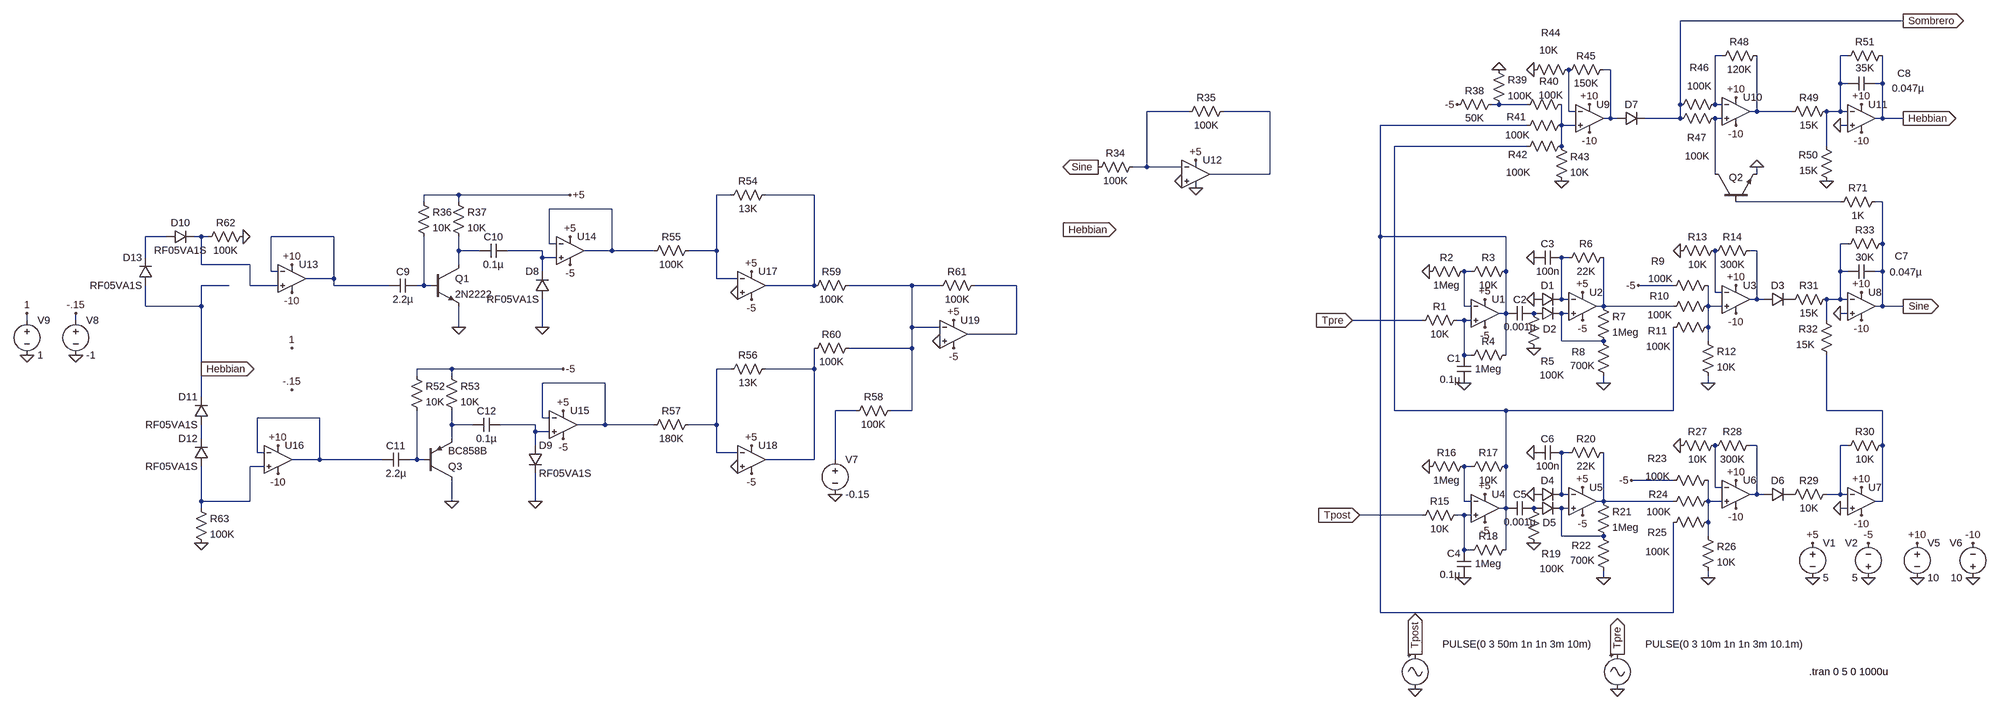
[diagram p0: schematic In-Ex-PulseV2.asc]
In-Ex-PulseV2.asc, the LTspice schematic file:
Version 4
SHEET 1 2784 1552
WIRE 1184 -672 672 -672
WIRE 768 -592 752 -592
WIRE 1056 -592 1040 -592
WIRE 512 -560 496 -560
WIRE 1040 -528 1040 -592
WIRE 1056 -528 1040 -528
WIRE 1136 -528 1136 -592
WIRE 1136 -528 1120 -528
WIRE 256 -480 240 -480
WIRE 320 -480 256 -480
WIRE 672 -480 672 -672
WIRE 752 -480 752 -592
WIRE 768 -480 752 -480
WIRE -1424 -464 -1520 -464
WIRE -1216 -464 -1344 -464
WIRE 416 -464 416 -560
WIRE 432 -464 416 -464
WIRE 848 -464 848 -592
WIRE 848 -464 832 -464
WIRE 928 -464 848 -464
WIRE 1040 -464 1040 -528
WIRE 1040 -464 1008 -464
WIRE 1056 -464 1040 -464
WIRE 512 -448 512 -560
WIRE 512 -448 496 -448
WIRE 528 -448 512 -448
WIRE 672 -448 672 -480
WIRE 672 -448 592 -448
WIRE 768 -448 752 -448
WIRE 1136 -448 1136 -528
WIRE 1136 -448 1120 -448
WIRE 1184 -448 1136 -448
WIRE 320 -432 -16 -432
WIRE 400 -432 400 -480
WIRE 432 -432 400 -432
WIRE 1056 -432 1040 -432
WIRE 320 -384 16 -384
WIRE 400 -384 400 -432
WIRE 1008 -384 1008 -464
WIRE -1520 -336 -1520 -464
WIRE -1520 -336 -1552 -336
WIRE -1440 -336 -1520 -336
WIRE -1216 -320 -1216 -464
WIRE -1216 -320 -1376 -320
WIRE 752 -320 752 -448
WIRE 848 -320 848 -336
WIRE -3248 -272 -3328 -272
WIRE -2992 -272 -3248 -272
WIRE -2624 -272 -2656 -272
WIRE -2432 -272 -2544 -272
WIRE -3328 -256 -3328 -272
WIRE -3248 -256 -3248 -272
WIRE 1040 -256 800 -256
WIRE 1136 -256 1120 -256
WIRE -2896 -240 -3040 -240
WIRE -3952 -176 -4000 -176
WIRE -3872 -176 -3888 -176
WIRE -3856 -176 -3872 -176
WIRE -3568 -176 -3712 -176
WIRE -16 -176 -16 -432
WIRE 272 -176 -16 -176
WIRE -3040 -160 -3040 -240
WIRE -3024 -160 -3040 -160
WIRE 1056 -160 1040 -160
WIRE 1136 -160 1136 -256
WIRE -3248 -144 -3248 -176
WIRE -3200 -144 -3248 -144
WIRE -3056 -144 -3136 -144
WIRE -2896 -144 -2896 -240
WIRE -2896 -144 -2960 -144
WIRE -2800 -144 -2896 -144
WIRE -2656 -144 -2656 -272
WIRE -2656 -144 -2720 -144
WIRE 848 -144 832 -144
WIRE -4000 -128 -4000 -176
WIRE -3056 -128 -3056 -144
WIRE -3024 -128 -3056 -128
WIRE 416 -128 400 -128
WIRE -3872 -112 -3872 -176
WIRE -3760 -112 -3872 -112
WIRE -3248 -112 -3248 -144
WIRE -3712 -96 -3712 -176
WIRE -3696 -96 -3712 -96
WIRE -3056 -96 -3056 -128
WIRE 192 -96 176 -96
WIRE 272 -96 272 -176
WIRE 1040 -96 1040 -160
WIRE 1056 -96 1040 -96
WIRE 1136 -96 1136 -160
WIRE 1136 -96 1120 -96
WIRE -3568 -80 -3568 -176
WIRE -3568 -80 -3632 -80
WIRE -2656 -80 -2656 -144
WIRE -2608 -80 -2656 -80
WIRE -3808 -64 -3872 -64
WIRE -3760 -64 -3760 -112
WIRE -3696 -64 -3760 -64
WIRE -3568 -64 -3568 -80
WIRE -3408 -64 -3568 -64
WIRE -3328 -64 -3328 -176
WIRE -3328 -64 -3344 -64
WIRE -3312 -64 -3328 -64
WIRE -2432 -64 -2432 -272
WIRE -2432 -64 -2544 -64
WIRE -2208 -64 -2352 -64
WIRE -2144 -64 -2208 -64
WIRE -1968 -64 -2064 -64
WIRE 656 -64 576 -64
WIRE 752 -48 752 -144
WIRE 768 -48 752 -48
WIRE 400 -32 400 -128
WIRE 416 -32 400 -32
WIRE 848 -32 848 -144
WIRE 848 -32 832 -32
WIRE 864 -32 848 -32
WIRE 1040 -32 1040 -96
WIRE 1040 -32 1008 -32
WIRE 1056 -32 1040 -32
WIRE -4000 -16 -4000 -64
WIRE -3872 -16 -3872 -64
WIRE -3872 -16 -4000 -16
WIRE 176 -16 176 -96
WIRE 192 -16 176 -16
WIRE 496 -16 496 -128
WIRE 496 -16 480 -16
WIRE 656 -16 496 -16
WIRE 736 -16 736 -64
WIRE 768 -16 736 -16
WIRE 1136 -16 1136 -96
WIRE 1136 -16 1120 -16
WIRE 1184 -16 1136 -16
WIRE 272 0 272 -96
WIRE 272 0 256 0
WIRE 416 0 400 0
WIRE 1056 0 1040 0
WIRE -4272 16 -4272 0
WIRE -4160 16 -4160 0
WIRE 80 16 -80 16
WIRE 176 16 160 16
WIRE 192 16 176 16
WIRE 1008 16 1008 -32
WIRE -3248 32 -3248 -16
WIRE -3056 32 -3056 -32
WIRE -2208 32 -2208 -64
WIRE -2144 32 -2208 32
WIRE 736 32 736 -16
WIRE -1968 48 -1968 -64
WIRE -1968 48 -2080 48
WIRE 400 64 400 0
WIRE 496 64 400 64
WIRE 736 64 736 32
WIRE -2208 80 -2208 32
WIRE -2208 80 -2352 80
WIRE 176 96 176 16
WIRE 192 96 176 96
WIRE 272 96 272 0
WIRE -3872 128 -3872 -16
WIRE -3264 128 -3344 128
WIRE -3008 128 -3264 128
WIRE -2624 128 -2656 128
WIRE -2432 128 -2432 80
WIRE -2432 128 -2544 128
WIRE -3344 144 -3344 128
WIRE -3264 144 -3264 128
WIRE -2912 160 -3056 160
WIRE 496 160 496 144
WIRE 736 160 736 144
WIRE -3872 192 -3872 128
WIRE -2336 224 -2384 224
WIRE -2208 224 -2208 80
WIRE -2208 224 -2256 224
WIRE 16 224 16 -384
WIRE 272 224 16 224
WIRE 656 224 656 32
WIRE 656 224 272 224
WIRE 1008 224 1008 96
WIRE 1136 224 1008 224
WIRE -3600 240 -3744 240
WIRE -3056 240 -3056 160
WIRE -3040 240 -3056 240
WIRE -3264 256 -3264 224
WIRE -3216 256 -3264 256
WIRE -3072 256 -3152 256
WIRE -2912 256 -2912 160
WIRE -2912 256 -2976 256
WIRE -2800 256 -2912 256
WIRE -2656 256 -2656 128
WIRE -2656 256 -2720 256
WIRE -3072 272 -3072 256
WIRE -3040 272 -3072 272
WIRE -3872 288 -3872 256
WIRE -3264 288 -3264 256
WIRE -3072 304 -3072 272
WIRE 848 304 832 304
WIRE 1056 304 1040 304
WIRE 1136 304 1136 224
WIRE -3744 320 -3744 240
WIRE -3728 320 -3744 320
WIRE -2656 320 -2656 256
WIRE -2608 320 -2656 320
WIRE 416 320 400 320
WIRE -3600 336 -3600 240
WIRE -3600 336 -3664 336
WIRE -3424 336 -3600 336
WIRE -3344 336 -3344 224
WIRE -3344 336 -3360 336
WIRE -3328 336 -3344 336
WIRE -2432 336 -2432 128
WIRE -2432 336 -2544 336
WIRE -2384 336 -2384 224
WIRE -3728 352 -3760 352
WIRE 192 352 176 352
WIRE 272 352 272 224
WIRE 656 384 560 384
WIRE 752 400 752 304
WIRE 768 400 752 400
WIRE 400 416 400 320
WIRE 416 416 400 416
WIRE 848 416 848 304
WIRE 848 416 832 416
WIRE 864 416 848 416
WIRE 1040 416 1040 304
WIRE 1040 416 1008 416
WIRE 1056 416 1040 416
WIRE -3872 432 -3872 352
WIRE -3760 432 -3760 352
WIRE -3760 432 -3872 432
WIRE -3264 432 -3264 384
WIRE -3072 432 -3072 368
WIRE 176 432 176 352
WIRE 192 432 176 432
WIRE 496 432 496 320
WIRE 496 432 480 432
WIRE 656 432 496 432
WIRE 736 432 736 384
WIRE 768 432 736 432
WIRE 1136 432 1136 304
WIRE 1136 432 1120 432
WIRE -3872 448 -3872 432
WIRE 272 448 272 352
WIRE 272 448 256 448
WIRE 416 448 400 448
WIRE 1056 448 1040 448
WIRE 80 464 -64 464
WIRE 176 464 160 464
WIRE 192 464 176 464
WIRE 736 480 736 432
WIRE 400 512 400 448
WIRE 496 512 400 512
WIRE 736 512 736 480
WIRE 176 544 176 464
WIRE 192 544 176 544
WIRE 272 544 272 448
WIRE 496 608 496 592
WIRE 736 608 736 592
WIRE -16 688 -16 -176
WIRE 656 688 656 480
WIRE 656 688 -16 688
FLAG 528 864 0
FLAG 64 864 0
FLAG 224 -32 +5
FLAG 224 32 -5
FLAG 448 -48 +5
FLAG 448 16 -5
FLAG 336 -32 0
FLAG 336 -128 0
FLAG 336 80 0
FLAG 672 -144 0
FLAG 576 -64 -5
FLAG 448 400 +5
FLAG 448 464 -5
FLAG 336 416 0
FLAG 336 320 0
FLAG 336 528 0
FLAG 496 608 0
FLAG 496 160 0
FLAG 672 304 0
FLAG 560 384 -5
FLAG 176 160 0
FLAG 96 -96 0
FLAG 224 416 +5
FLAG 224 480 -5
FLAG 176 608 0
FLAG 96 352 0
FLAG 1040 448 0
FLAG 1040 0 0
FLAG 736 160 0
FLAG 736 608 0
FLAG 1184 -16 Sine
IOPIN 1184 -16 Out
FLAG 336 -560 0
FLAG 256 -560 0
FLAG 160 -480 -5
FLAG 1040 -432 0
FLAG 1008 -304 0
FLAG 848 -336 0
FLAG 1184 -448 Hebbian
IOPIN 1184 -448 Out
FLAG 1184 -672 Sombrero
IOPIN 1184 -672 Out
FLAG 976 608 0
FLAG 1104 608 0
FLAG 1104 528 -5
FLAG 976 528 +5
FLAG -64 464 Tpost
IOPIN -64 464 In
FLAG 64 784 Tpost
IOPIN 64 784 Out
FLAG -80 16 Tpre
IOPIN -80 16 In
FLAG 528 784 Tpre
IOPIN 528 784 Out
FLAG 400 -304 0
FLAG 1216 608 0
FLAG 1344 608 0
FLAG 1344 528 -10
FLAG 1216 528 +10
FLAG 800 -64 +10
FLAG 800 384 +10
FLAG 1088 400 +10
FLAG 1088 -48 +10
FLAG 800 0 -10
FLAG 1088 16 -10
FLAG 800 448 -10
FLAG 1088 464 -10
FLAG 464 -416 -10
FLAG 800 -432 -10
FLAG 1088 -416 -10
FLAG 1088 -480 +10
FLAG 800 -496 +10
FLAG 464 -480 +10
FLAG -1632 -336 Sine
IOPIN -1632 -336 Out
FLAG -1408 -352 +5
FLAG -1408 -288 0
FLAG -1440 -304 0
FLAG -1712 -192 Hebbian
IOPIN -1712 -192 Out
FLAG -3056 32 0
FLAG -3248 32 0
FLAG -2992 -272 +5
FLAG -2992 -176 +5
FLAG -2992 -112 -5
FLAG -3072 432 0
FLAG -3264 432 0
FLAG -3008 224 +5
FLAG -3008 288 -5
FLAG -3008 128 -5
FLAG -2576 -96 +5
FLAG -2576 -32 -5
FLAG -2608 -48 0
FLAG -2384 416 0
FLAG -2576 304 +5
FLAG -2576 368 -5
FLAG -2608 352 0
FLAG -3872 128 Hebbian
IOPIN -3872 128 Out
FLAG -3664 -112 +10
FLAG -3696 368 -10
FLAG -4160 96 0
FLAG -4160 0 -.15
FLAG -3664 176 -.15
FLAG -4272 96 0
FLAG -4272 0 1
FLAG -3664 80 1
FLAG -2112 16 +5
FLAG -2112 80 -5
FLAG -2144 64 0
FLAG -3776 -176 0
FLAG -3872 528 0
FLAG -3696 304 +10
FLAG -3664 -48 -10
SYMBOL Opamps\\UniversalOpamp2 800 -32 R0
SYMATTR InstName U3
SYMBOL res 848 -160 R90
WINDOW 0 0 56 VBottom 2
WINDOW 3 32 56 VTop 2
SYMATTR InstName R14
SYMATTR Value 300K
SYMBOL res 720 48 R0
SYMATTR InstName R12
SYMATTR Value 10K
SYMBOL res 752 -32 R90
WINDOW 0 8 128 VBottom 2
WINDOW 3 20 127 VTop 2
SYMATTR InstName R10
SYMATTR Value 100K
SYMBOL Opamps\\UniversalOpamp2 224 0 R0
SYMATTR InstName U1
SYMBOL cap 192 160 R180
WINDOW 0 24 56 Left 2
WINDOW 3 24 8 Left 2
SYMATTR InstName C1
SYMATTR Value 0.1µ
SYMBOL res 176 0 R90
WINDOW 0 0 56 VBottom 2
WINDOW 3 32 56 VTop 2
SYMATTR InstName R1
SYMATTR Value 10K
SYMBOL res 176 448 R90
WINDOW 0 0 56 VBottom 2
WINDOW 3 32 56 VTop 2
SYMATTR InstName R15
SYMATTR Value 10K
SYMBOL res 288 -112 R90
WINDOW 0 0 56 VBottom 2
WINDOW 3 32 56 VTop 2
SYMATTR InstName R3
SYMATTR Value 10K
SYMBOL res 752 16 R90
WINDOW 0 40 132 VBottom 2
WINDOW 3 45 130 VTop 2
SYMATTR InstName R11
SYMATTR Value 100K
SYMBOL Opamps\\UniversalOpamp2 448 -16 R0
SYMATTR InstName U2
SYMBOL diode 336 -16 R270
WINDOW 0 32 32 VTop 2
WINDOW 3 0 32 Invisible 2
SYMATTR InstName D1
SYMBOL diode 336 16 R270
WINDOW 0 -36 37 VTop 2
WINDOW 3 0 32 Invisible 2
SYMATTR InstName D2
SYMBOL res 480 -32 R0
SYMATTR InstName R7
SYMATTR Value 1Meg
SYMBOL res 512 160 R180
WINDOW 0 58 71 Left 2
WINDOW 3 36 40 Left 2
SYMATTR InstName R8
SYMATTR Value 700K
SYMBOL res 320 -16 R0
WINDOW 0 32 126 Left 2
WINDOW 3 30 158 Left 2
SYMATTR InstName R5
SYMATTR Value 100K
SYMBOL cap 336 -16 R90
WINDOW 0 0 32 VBottom 2
WINDOW 3 32 32 VTop 2
SYMATTR InstName C2
SYMATTR Value 0.001µ
SYMBOL res 512 -144 R90
WINDOW 0 0 56 VBottom 2
WINDOW 3 32 56 VTop 2
SYMATTR InstName R6
SYMATTR Value 22K
SYMBOL cap 400 -144 R90
WINDOW 0 0 32 VBottom 2
WINDOW 3 32 32 VTop 2
SYMATTR InstName C3
SYMATTR Value 100n
SYMBOL res 656 -128 R270
WINDOW 0 32 56 VTop 2
WINDOW 3 0 56 VBottom 2
SYMATTR InstName R13
SYMATTR Value 10K
SYMBOL diode 864 -16 R270
WINDOW 0 32 32 VTop 2
WINDOW 3 0 32 Invisible 2
SYMATTR InstName D3
SYMBOL res 752 -80 R90
WINDOW 0 -24 131 VBottom 2
WINDOW 3 -15 125 VTop 2
SYMATTR InstName R9
SYMATTR Value 100K
SYMBOL Opamps\\UniversalOpamp2 448 432 R0
SYMATTR InstName U5
SYMBOL diode 336 432 R270
WINDOW 0 32 32 VTop 2
WINDOW 3 0 32 Invisible 2
SYMATTR InstName D4
SYMBOL diode 336 464 R270
WINDOW 0 -33 36 VTop 2
WINDOW 3 0 32 Invisible 2
SYMATTR InstName D5
SYMBOL res 480 416 R0
SYMATTR InstName R21
SYMATTR Value 1Meg
SYMBOL res 512 608 R180
WINDOW 0 45 74 Left 2
WINDOW 3 36 40 Left 2
SYMATTR InstName R22
SYMATTR Value 700K
SYMBOL res 320 432 R0
WINDOW 0 34 121 Left 2
WINDOW 3 30 155 Left 2
SYMATTR InstName R19
SYMATTR Value 100K
SYMBOL res 512 304 R90
WINDOW 0 0 56 VBottom 2
WINDOW 3 32 56 VTop 2
SYMATTR InstName R20
SYMATTR Value 22K
SYMBOL cap 400 304 R90
WINDOW 0 0 32 VBottom 2
WINDOW 3 32 32 VTop 2
SYMATTR InstName C6
SYMATTR Value 100n
SYMBOL cap 336 432 R90
WINDOW 0 0 32 VBottom 2
WINDOW 3 32 32 VTop 2
SYMATTR InstName C5
SYMATTR Value 0.001µ
SYMBOL Opamps\\UniversalOpamp2 800 416 R0
SYMATTR InstName U6
SYMBOL res 848 288 R90
WINDOW 0 0 56 VBottom 2
WINDOW 3 32 56 VTop 2
SYMATTR InstName R28
SYMATTR Value 300K
SYMBOL res 720 496 R0
SYMATTR InstName R26
SYMATTR Value 10K
SYMBOL res 752 416 R90
WINDOW 0 16 130 VBottom 2
WINDOW 3 25 129 VTop 2
SYMATTR InstName R24
SYMATTR Value 100K
SYMBOL res 752 464 R90
WINDOW 0 55 133 VBottom 2
WINDOW 3 68 132 VTop 2
SYMATTR InstName R25
SYMATTR Value 100K
SYMBOL res 656 320 R270
WINDOW 0 32 56 VTop 2
WINDOW 3 0 56 VBottom 2
SYMATTR InstName R27
SYMATTR Value 10K
SYMBOL diode 864 432 R270
WINDOW 0 32 32 VTop 2
WINDOW 3 0 32 Invisible 2
SYMATTR InstName D6
SYMBOL res 752 368 R90
WINDOW 0 -19 133 VBottom 2
WINDOW 3 -9 132 VTop 2
SYMATTR InstName R23
SYMATTR Value 100K
SYMBOL res 1152 -176 R90
WINDOW 0 0 56 VBottom 2
WINDOW 3 32 56 VTop 2
SYMATTR InstName R33
SYMATTR Value 30K
SYMBOL res 1024 -48 R90
WINDOW 0 0 56 VBottom 2
WINDOW 3 32 56 VTop 2
SYMATTR InstName R31
SYMATTR Value 15K
SYMBOL res 1024 112 R180
WINDOW 0 36 76 Left 2
WINDOW 3 43 40 Left 2
SYMATTR InstName R32
SYMATTR Value 15K
SYMBOL res 288 80 R90
WINDOW 0 0 56 VBottom 2
WINDOW 3 32 56 VTop 2
SYMATTR InstName R4
SYMATTR Value 1Meg
SYMBOL res 192 -112 R90
WINDOW 0 0 56 VBottom 2
WINDOW 3 32 56 VTop 2
SYMATTR InstName R2
SYMATTR Value 1Meg
SYMBOL Opamps\\UniversalOpamp2 224 448 R0
SYMATTR InstName U4
SYMBOL cap 192 608 R180
WINDOW 0 24 56 Left 2
WINDOW 3 24 8 Left 2
SYMATTR InstName C4
SYMATTR Value 0.1µ
SYMBOL res 288 336 R90
WINDOW 0 0 56 VBottom 2
WINDOW 3 32 56 VTop 2
SYMATTR InstName R17
SYMATTR Value 10K
SYMBOL res 288 528 R90
WINDOW 0 0 56 VBottom 2
WINDOW 3 32 56 VTop 2
SYMATTR InstName R18
SYMATTR Value 1Meg
SYMBOL res 192 336 R90
WINDOW 0 0 56 VBottom 2
WINDOW 3 32 56 VTop 2
SYMATTR InstName R16
SYMATTR Value 1Meg
SYMBOL Opamps\\UniversalOpamp2 1088 -16 R0
SYMATTR InstName U8
SYMBOL res 1152 288 R90
WINDOW 0 0 56 VBottom 2
WINDOW 3 32 56 VTop 2
SYMATTR InstName R30
SYMATTR Value 10K
SYMBOL Opamps\\UniversalOpamp2 1088 432 R0
SYMATTR InstName U7
SYMBOL res 1024 400 R90
WINDOW 0 0 56 VBottom 2
WINDOW 3 32 56 VTop 2
SYMATTR InstName R29
SYMATTR Value 10K
SYMBOL cap 1120 -112 R90
WINDOW 0 -4 -60 VBottom 2
WINDOW 3 2 -70 VTop 2
SYMATTR InstName C7
SYMATTR Value 0.047µ
SYMBOL Opamps\\UniversalOpamp2 464 -448 R0
SYMATTR InstName U9
SYMBOL res 512 -576 R90
WINDOW 0 0 56 VBottom 2
WINDOW 3 32 56 VTop 2
SYMATTR InstName R45
SYMATTR Value 150K
SYMBOL res 384 -400 R0
SYMATTR InstName R43
SYMATTR Value 10K
SYMBOL res 416 -448 R90
WINDOW 0 12 120 VBottom 2
WINDOW 3 23 117 VTop 2
SYMATTR InstName R41
SYMATTR Value 100K
SYMBOL res 320 -544 R270
WINDOW 0 85 55 VTop 2
WINDOW 3 76 50 VBottom 2
SYMATTR InstName R44
SYMATTR Value 10K
SYMBOL res 416 -496 R90
WINDOW 0 -21 45 VBottom 2
WINDOW 3 -21 41 VTop 2
SYMATTR InstName R40
SYMATTR Value 100K
SYMBOL res 240 -576 R0
SYMATTR InstName R39
SYMATTR Value 100K
SYMBOL res 256 -496 R90
WINDOW 0 0 56 VBottom 2
WINDOW 3 32 56 VTop 2
SYMATTR InstName R38
SYMATTR Value 50K
SYMBOL diode 528 -432 R270
WINDOW 0 32 32 VTop 2
WINDOW 3 0 32 Invisible 2
SYMATTR InstName D7
SYMBOL res 864 -608 R90
WINDOW 0 0 56 VBottom 2
WINDOW 3 32 56 VTop 2
SYMATTR InstName R48
SYMATTR Value 120K
SYMBOL Opamps\\UniversalOpamp2 800 -464 R0
SYMATTR InstName U10
SYMBOL res 768 -496 R90
WINDOW 0 -53 52 VBottom 2
WINDOW 3 -42 52 VTop 2
SYMATTR InstName R46
SYMATTR Value 100K
SYMBOL res 768 -464 R90
WINDOW 0 76 58 VBottom 2
WINDOW 3 87 57 VTop 2
SYMATTR InstName R47
SYMATTR Value 100K
SYMBOL npn 752 -256 R270
WINDOW 0 56 32 VRight 2
WINDOW 3 56 68 Invisible 2
SYMATTR InstName Q2
SYMBOL res 1152 -608 R90
WINDOW 0 0 56 VBottom 2
WINDOW 3 60 56 VBottom 2
SYMATTR InstName R51
SYMATTR Value 35K
SYMBOL res 1024 -480 R90
WINDOW 0 0 56 VBottom 2
WINDOW 3 32 56 VTop 2
SYMATTR InstName R49
SYMATTR Value 15K
SYMBOL res 1024 -288 R180
WINDOW 0 36 76 Left 2
WINDOW 3 36 40 Left 2
SYMATTR InstName R50
SYMATTR Value 15K
SYMBOL Opamps\\UniversalOpamp2 1088 -448 R0
SYMATTR InstName U11
SYMBOL cap 1120 -544 R90
WINDOW 0 8 -66 VBottom 2
WINDOW 3 11 -75 VTop 2
SYMATTR InstName C8
SYMATTR Value 0.047µ
SYMBOL res 1024 -240 R270
WINDOW 0 32 56 VTop 2
WINDOW 3 0 56 VBottom 2
SYMATTR InstName R71
SYMATTR Value 1K
SYMBOL voltage 976 512 R0
WINDOW 123 0 0 Left 2
WINDOW 39 0 0 Left 2
SYMATTR InstName V1
SYMATTR Value 5
SYMBOL voltage 1104 624 R180
WINDOW 0 24 96 Left 2
WINDOW 3 24 16 Left 2
WINDOW 123 0 0 Left 2
WINDOW 39 0 0 Left 2
SYMATTR InstName V2
SYMATTR Value 5
SYMBOL Misc\\signal 64 768 R0
WINDOW 0 24 16 Invisible 2
WINDOW 3 62 -8 Left 2
WINDOW 123 0 0 Left 2
WINDOW 39 0 0 Left 2
SYMATTR InstName V3
SYMATTR Value PULSE(0 3 50m 1n 1n 3m 10m)
SYMBOL Misc\\signal 528 768 R0
WINDOW 0 24 16 Invisible 2
WINDOW 3 64 -8 Left 2
WINDOW 123 0 0 Left 2
WINDOW 39 0 0 Left 2
SYMATTR InstName V4
SYMATTR Value PULSE(0 3 10m 1n 1n 3m 10.1m)
SYMBOL res 416 -400 R90
WINDOW 0 51 117 VBottom 2
WINDOW 3 61 116 VTop 2
SYMATTR InstName R42
SYMATTR Value 100K
SYMBOL voltage 1216 512 R0
WINDOW 123 0 0 Left 2
WINDOW 39 0 0 Left 2
SYMATTR InstName V5
SYMATTR Value 10
SYMBOL voltage 1344 624 R180
WINDOW 0 24 96 Left 2
WINDOW 3 24 16 Left 2
WINDOW 123 0 0 Left 2
WINDOW 39 0 0 Left 2
SYMATTR InstName V6
SYMATTR Value 10
SYMBOL Opamps\\UniversalOpamp2 -1408 -320 R0
SYMATTR InstName U12
SYMBOL res -1536 -352 R90
WINDOW 0 0 56 VBottom 2
WINDOW 3 32 56 VTop 2
SYMATTR InstName R34
SYMATTR Value 100K
SYMBOL res -1328 -480 R90
WINDOW 0 0 56 VBottom 2
WINDOW 3 32 56 VTop 2
SYMATTR InstName R35
SYMATTR Value 100K
SYMBOL cap -3344 -80 R90
WINDOW 0 0 32 VBottom 2
WINDOW 3 32 32 VTop 2
SYMATTR InstName C9
SYMATTR Value 2.2µ
SYMBOL res -3344 -272 R0
SYMATTR InstName R36
SYMATTR Value 10K
SYMBOL res -3264 -272 R0
SYMATTR InstName R37
SYMATTR Value 10K
SYMBOL npn -3312 -112 R0
SYMATTR InstName Q1
SYMATTR Value 2N2222
SYMBOL cap -3136 -160 R90
WINDOW 0 0 32 VBottom 2
WINDOW 3 32 32 VTop 2
SYMATTR InstName C10
SYMATTR Value 0.1µ
SYMBOL diode -3040 -32 R180
WINDOW 0 24 64 Left 2
WINDOW 3 24 0 Left 2
SYMATTR InstName D8
SYMATTR Value RF05VA1S
SYMBOL Opamps\\UniversalOpamp2 -3664 -80 R0
SYMATTR InstName U13
SYMBOL Opamps\\UniversalOpamp2 -2992 -144 R0
SYMATTR InstName U14
SYMBOL cap -3360 320 R90
WINDOW 0 0 32 VBottom 2
WINDOW 3 32 32 VTop 2
SYMATTR InstName C11
SYMATTR Value 2.2µ
SYMBOL res -3360 128 R0
SYMATTR InstName R52
SYMATTR Value 10K
SYMBOL res -3280 128 R0
SYMATTR InstName R53
SYMATTR Value 10K
SYMBOL cap -3152 240 R90
WINDOW 0 0 32 VBottom 2
WINDOW 3 32 32 VTop 2
SYMATTR InstName C12
SYMATTR Value 0.1µ
SYMBOL diode -3088 304 R0
SYMATTR InstName D9
SYMATTR Value RF05VA1S
SYMBOL Opamps\\UniversalOpamp2 -3008 256 R0
SYMATTR InstName U15
SYMBOL pnp -3328 384 M180
SYMATTR InstName Q3
SYMATTR Value BC858B
SYMBOL Opamps\\UniversalOpamp2 -3696 336 R0
SYMATTR InstName U16
SYMBOL Opamps\\UniversalOpamp2 -2576 -64 R0
SYMATTR InstName U17
SYMBOL res -2528 -288 R90
WINDOW 0 0 56 VBottom 2
WINDOW 3 32 56 VTop 2
SYMATTR InstName R54
SYMATTR Value 13K
SYMBOL res -2704 -160 R90
WINDOW 0 0 56 VBottom 2
WINDOW 3 32 56 VTop 2
SYMATTR InstName R55
SYMATTR Value 100K
SYMBOL voltage -2384 320 R0
WINDOW 123 0 0 Left 2
WINDOW 39 0 0 Left 2
SYMATTR InstName V7
SYMATTR Value -0.15
SYMBOL Opamps\\UniversalOpamp2 -2576 336 R0
SYMATTR InstName U18
SYMBOL res -2528 112 R90
WINDOW 0 0 56 VBottom 2
WINDOW 3 32 56 VTop 2
SYMATTR InstName R56
SYMATTR Value 13K
SYMBOL res -2704 240 R90
WINDOW 0 0 56 VBottom 2
WINDOW 3 32 56 VTop 2
SYMATTR InstName R57
SYMATTR Value 180K
SYMBOL res -2240 208 R90
WINDOW 0 0 56 VBottom 2
WINDOW 3 32 56 VTop 2
SYMATTR InstName R58
SYMATTR Value 100K
SYMBOL voltage -4160 0 R0
WINDOW 123 0 0 Left 2
WINDOW 39 0 0 Left 2
SYMATTR InstName V8
SYMATTR Value -1
SYMBOL voltage -4272 0 R0
WINDOW 123 0 0 Left 2
WINDOW 39 0 0 Left 2
SYMATTR InstName V9
SYMATTR Value 1
SYMBOL Opamps\\UniversalOpamp2 -2112 48 R0
SYMATTR InstName U19
SYMBOL res -2336 -80 R90
WINDOW 0 0 56 VBottom 2
WINDOW 3 32 56 VTop 2
SYMATTR InstName R59
SYMATTR Value 100K
SYMBOL res -2336 64 R90
WINDOW 0 0 56 VBottom 2
WINDOW 3 32 56 VTop 2
SYMATTR InstName R60
SYMATTR Value 100K
SYMBOL res -2048 -80 R90
WINDOW 0 0 56 VBottom 2
WINDOW 3 32 56 VTop 2
SYMATTR InstName R61
SYMATTR Value 100K
SYMBOL diode -3952 -160 R270
WINDOW 0 32 32 VTop 2
WINDOW 3 0 32 VBottom 2
SYMATTR InstName D10
SYMATTR Value RF05VA1S
SYMBOL diode -3856 256 R180
WINDOW 0 24 64 Left 2
WINDOW 3 24 0 Left 2
SYMATTR InstName D11
SYMATTR Value RF05VA1S
SYMBOL res -3760 -192 R90
WINDOW 0 0 56 VBottom 2
WINDOW 3 32 56 VTop 2
SYMATTR InstName R62
SYMATTR Value 100K
SYMBOL res -3888 432 R0
SYMATTR InstName R63
SYMATTR Value 100K
SYMBOL diode -3856 352 R180
WINDOW 0 24 64 Left 2
WINDOW 3 24 0 Left 2
SYMATTR InstName D12
SYMATTR Value RF05VA1S
SYMBOL diode -3984 -64 R180
WINDOW 0 24 64 Left 2
WINDOW 3 24 0 Left 2
SYMATTR InstName D13
SYMATTR Value RF05VA1S
TEXT 968 824 Left 2 !.tran 0 5 0 1000u

The netlist it stands for:
* In-Ex-PulseV2.asc
XU3 N031 N029 +10 -10 N023 level.2 Avol=1Meg GBW=10Meg Slew=10Meg ilimit=25m rail=0 Vos=0 phimargin=45 en=0 enk=0 in=0 ink=0 Rin=500Meg  ; pins IN+ IN- V+ V- OUT
R14 N023 N029 300K
R12 N031 0 10K
R10 N031 N030 100K
XU1 N033 N025 +5 -5 N010 level.2 Avol=1Meg GBW=10Meg Slew=10Meg ilimit=25m rail=0 Vos=0 phimargin=45 en=0 enk=0 in=0 ink=0 Rin=500Meg  ; pins IN+ IN- V+ V- OUT
C1 0 N033 0.1µ
R1 N033 Tpre 10K
R15 N053 Tpost 10K
R3 N010 N025 10K
R11 N031 N012 100K
XU2 N032 N024 +5 -5 N030 level.2 Avol=1Meg GBW=10Meg Slew=10Meg ilimit=25m rail=0 Vos=0 phimargin=45 en=0 enk=0 in=0 ink=0 Rin=500Meg  ; pins IN+ IN- V+ V- OUT
D1 0 N024 D
D2 P001 N032 D
R7 N030 N032 1Meg
R8 0 N032 700K
R5 P001 0 100K
C2 P001 N010 0.001µ
R6 N030 N024 22K
C3 N024 0 100n
R13 0 N029 10K
D3 N023 P002 D
R9 N031 -5 100K
XU5 N052 N045 +5 -5 N050 level.2 Avol=1Meg GBW=10Meg Slew=10Meg ilimit=25m rail=0 Vos=0 phimargin=45 en=0 enk=0 in=0 ink=0 Rin=500Meg  ; pins IN+ IN- V+ V- OUT
D4 0 N045 D
D5 P003 N052 D
R21 N050 N052 1Meg
R22 0 N052 700K
R19 P003 0 100K
R20 N050 N045 22K
C6 N045 0 100n
C5 P003 N012 0.001µ
XU6 N051 N049 +10 -10 N043 level.2 Avol=1Meg GBW=10Meg Slew=10Meg ilimit=25m rail=0 Vos=0 phimargin=45 en=0 enk=0 in=0 ink=0 Rin=500Meg  ; pins IN+ IN- V+ V- OUT
R28 N043 N049 300K
R26 N051 0 10K
R24 N051 N050 100K
R25 N051 N010 100K
R27 0 N049 10K
D6 N043 P004 D
R23 N051 -5 100K
R33 Sine N020 30K
R31 N020 P002 15K
R32 N038 N020 15K
R4 N010 N033 1Meg
R2 N025 0 1Meg
XU4 N053 N048 +5 -5 N012 level.2 Avol=1Meg GBW=10Meg Slew=10Meg ilimit=25m rail=0 Vos=0 phimargin=45 en=0 enk=0 in=0 ink=0 Rin=500Meg  ; pins IN+ IN- V+ V- OUT
C4 0 N053 0.1µ
R17 N012 N048 10K
R18 N012 N053 1Meg
R16 N048 0 1Meg
XU8 0 N020 +10 -10 Sine level.2 Avol=1Meg GBW=10Meg Slew=10Meg ilimit=25m rail=0 Vos=0 phimargin=45 en=0 enk=0 in=0 ink=0 Rin=500Meg  ; pins IN+ IN- V+ V- OUT
R30 N038 N044 10K
XU7 0 N044 +10 -10 N038 level.2 Avol=1Meg GBW=10Meg Slew=10Meg ilimit=25m rail=0 Vos=0 phimargin=45 en=0 enk=0 in=0 ink=0 Rin=500Meg  ; pins IN+ IN- V+ V- OUT
R29 N044 P004 10K
C7 Sine N020 0.047µ
XU9 N011 N007 +10 -10 N003 level.2 Avol=1Meg GBW=10Meg Slew=10Meg ilimit=25m rail=0 Vos=0 phimargin=45 en=0 enk=0 in=0 ink=0 Rin=500Meg  ; pins IN+ IN- V+ V- OUT
R45 N003 N007 150K
R43 N011 0 10K
R41 N011 N010 100K
R44 0 N007 10K
R40 N011 N004 100K
R39 0 N004 100K
R38 N004 -5 50K
D7 N003 Sombrero D
R48 N008 N001 120K
XU10 N009 N001 +10 -10 N008 level.2 Avol=1Meg GBW=10Meg Slew=10Meg ilimit=25m rail=0 Vos=0 phimargin=45 en=0 enk=0 in=0 ink=0 Rin=500Meg  ; pins IN+ IN- V+ V- OUT
R46 N001 Sombrero 100K
R47 N009 Sombrero 100K
Q2 N009 N015 0 0 NPN
R51 Hebbian N002 35K
R49 N002 N008 15K
R50 0 N002 15K
XU11 0 N002 +10 -10 Hebbian level.2 Avol=1Meg GBW=10Meg Slew=10Meg ilimit=25m rail=0 Vos=0 phimargin=45 en=0 enk=0 in=0 ink=0 Rin=500Meg  ; pins IN+ IN- V+ V- OUT
C8 Hebbian N002 0.047µ
R71 N015 Sine 1K
V1 +5 0 5
V2 0 -5 5
V3 Tpost 0 PULSE(0 3 50m 1n 1n 3m 10m)
V4 Tpre 0 PULSE(0 3 10m 1n 1n 3m 10.1m)
R42 N011 N012 100K
V5 +10 0 10
V6 0 -10 10
XU12 0 N005 +5 0 N006 level.2 Avol=1Meg GBW=10Meg Slew=10Meg ilimit=25m rail=0 Vos=0 phimargin=45 en=0 enk=0 in=0 ink=0 Rin=500Meg  ; pins IN+ IN- V+ V- OUT
R34 N005 Sine 100K
R35 N006 N005 100K
C9 N026 N019 2.2µ
R36 +5 N026 10K
R37 +5 N021 10K
Q1 N021 N026 0 0 2N2222
C10 N022 N021 0.1µ
D8 0 N022 RF05VA1S
XU13 N018 N019 +10 -10 N019 level.2 Avol=1Meg GBW=10Meg Slew=10Meg ilimit=25m rail=0 Vos=0 phimargin=45 en=0 enk=0 in=0 ink=0 Rin=500Meg  ; pins IN+ IN- V+ V- OUT
XU14 N022 N016 +5 -5 N016 level.2 Avol=1Meg GBW=10Meg Slew=10Meg ilimit=25m rail=0 Vos=0 phimargin=45 en=0 enk=0 in=0 ink=0 Rin=500Meg  ; pins IN+ IN- V+ V- OUT
C11 N046 N039 2.2µ
R52 -5 N046 10K
R53 -5 N040 10K
C12 N041 N040 0.1µ
D9 N041 0 RF05VA1S
XU15 N041 N036 +5 -5 N036 level.2 Avol=1Meg GBW=10Meg Slew=10Meg ilimit=25m rail=0 Vos=0 phimargin=45 en=0 enk=0 in=0 ink=0 Rin=500Meg  ; pins IN+ IN- V+ V- OUT
Q3 0 N046 N040 0 BC858B
XU16 N047 N039 +10 -10 N039 level.2 Avol=1Meg GBW=10Meg Slew=10Meg ilimit=25m rail=0 Vos=0 phimargin=45 en=0 enk=0 in=0 ink=0 Rin=500Meg  ; pins IN+ IN- V+ V- OUT
XU17 0 N013 +5 -5 N014 level.2 Avol=1Meg GBW=10Meg Slew=10Meg ilimit=25m rail=0 Vos=0 phimargin=45 en=0 enk=0 in=0 ink=0 Rin=500Meg  ; pins IN+ IN- V+ V- OUT
R54 N014 N013 13K
R55 N013 N016 100K
V7 N037 0 -0.15
XU18 0 N034 +5 -5 N035 level.2 Avol=1Meg GBW=10Meg Slew=10Meg ilimit=25m rail=0 Vos=0 phimargin=45 en=0 enk=0 in=0 ink=0 Rin=500Meg  ; pins IN+ IN- V+ V- OUT
R56 N035 N034 13K
R57 N034 N036 180K
R58 N027 N037 100K
V8 -.15 0 -1
V9 1 0 1
XU19 0 N027 +5 -5 N028 level.2 Avol=1Meg GBW=10Meg Slew=10Meg ilimit=25m rail=0 Vos=0 phimargin=45 en=0 enk=0 in=0 ink=0 Rin=500Meg  ; pins IN+ IN- V+ V- OUT
R59 N027 N014 100K
R60 N027 N035 100K
R61 N028 N027 100K
D10 N017 N018 RF05VA1S
D11 N042 Hebbian RF05VA1S
R62 0 N018 100K
R63 N047 0 100K
D12 N047 N042 RF05VA1S
D13 Hebbian N017 RF05VA1S
.model D D
.lib standard.dio
.model NPN NPN
.model PNP PNP
.lib standard.bjt
.tran 0 5 0 1000u
.lib UniversalOpamps2.sub
.backanno
.end